# Altium project HV DAC 8ch.PrjPCB (part 6 of 6)

## Sheet HV_Amp_Discrete.SchDoc: Power
size 420 x 297 mm; Author: G.Kasprowicz; CompanyName: WUT ISE; DrawnBy: G.Kasprowicz; Organization: WUT ISE; Address1: PW ISE; Address2: Nowowiejska 15/19 00-665 Warsaw; Address3: gkasprow@gmail.com; DocumentNumber: 2; Revision: 2; SheetNumber: 11; SheetTotal: 12; ModifiedBy: -; CheckedDate: -; Title2: Stage; DivGrp: WUT ISE; Designer: G.Kasprowicz; ModifiedDate: -; ProjectName: Sensor Box
Used 8 times, as channels U_HV_Amp_Discrete0, U_HV_Amp_Discrete1, U_HV_Amp_Discrete2, U_HV_Amp_Discrete3, U_HV_Amp_Discrete4, U_HV_Amp_Discrete5, U_HV_Amp_Discrete6, U_HV_Amp_Discrete7. Parts and nets are listed once, with the designators drawn on the sheet.
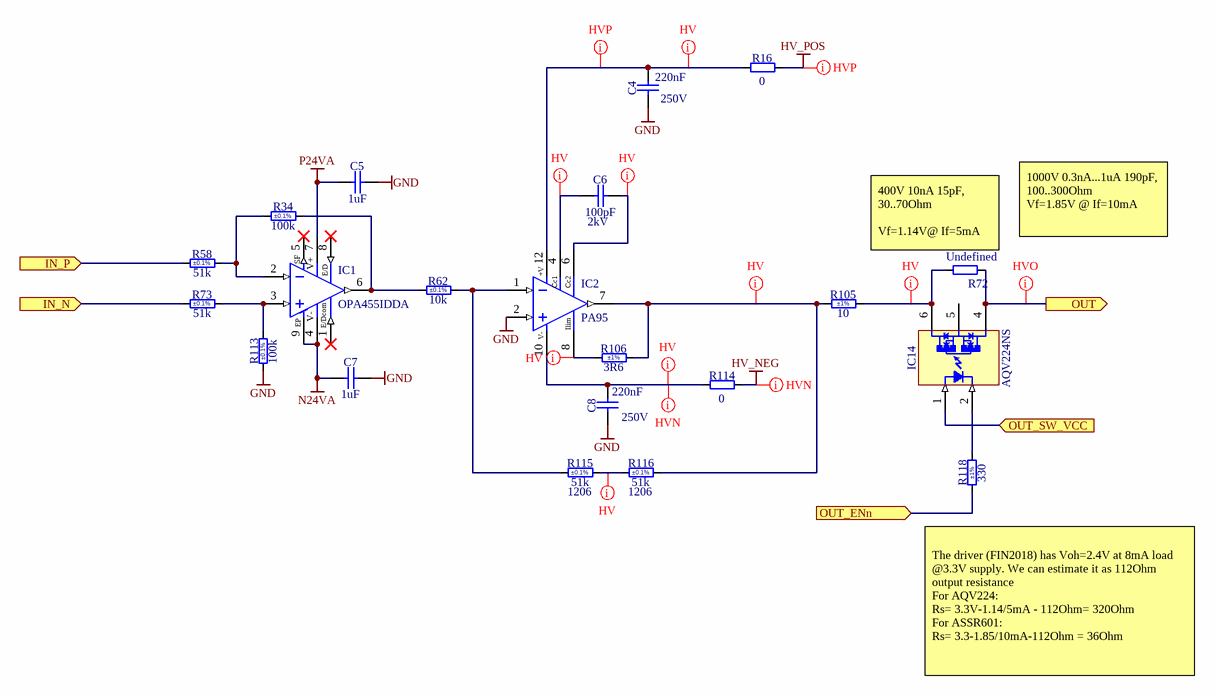
[diagram p9: HV_Amp_Discrete.SchDoc]

### Parts
C4  220nF  Voltage: 250V  [CAPC4532X165N]
C5  1uF  [CAPC1608X87N]
C6  100pF  Voltage: 2kV  [CAPC4620X203N]
C7  1uF  [CAPC1608X87N]
C8  220nF  Voltage: 250V  [CAPC4532X165N]
IC1  OPA455IDDA  [SOIC127P600X170-9N-R249X300]
IC2  PA95  [APEX_PA95_hflip]
IC14  AQV224NS  [PANASONIC_AQV22(SOP)]
R16  0  [RESC1608X55N]
R34  100k  Tolerance: ±0.1%  [RESC1608X55N]
R58  51k  Tolerance: ±0.1%  [RESC2012X60N]
R62  10k  Tolerance: ±0.1%  [RESC1608X64N]
R72  Undefined  [RESC3216X65N]
R73  51k  Tolerance: ±0.1%  [RESC2012X60N]
R105  10  Tolerance: ±1%  [RESC3216X65N]
R106  3R6  Tolerance: ±1%  [RESC1608X55N]
R113  100k  Tolerance: ±0.1%  [RESC1608X55N]
R114  0  [RESC1608X55N]
R115  51k  Tolerance: ±0.1%  Case: 1206  [RESC3216X65N]
R116  51k  Tolerance: ±0.1%  Case: 1206  [RESC3216X65N]
R118  330  Tolerance: ±1%  [RESC1005X40N]

### Ports
IN_N (in), IN_P (in), OUT (out), OUT_ENn (in), OUT_SW_VCC (in)

### Nets
GND: C4.1 C5.2 C7.2 C8.1 IC2.2(IN+) R113.1
HV_NEG: R114.2
HV_POS: R16.2
N24VA: C7.1 IC1.4(V-) IC1.9(Exposed_Pad)
P24VA: C5.1 IC1.7(V+)
IN_N: R73.1 ; port IN_N
IN_P: R58.1 ; port IN_P
OUT: IC14.4 R72.2 ; port OUT
OUT_ENn: R118.1 ; port OUT_ENn
OUT_SW_VCC: IC14.1(A) ; port OUT_SW_VCC
NetC4_2: C4.2 IC2.12(+Vs) R16.1
NetC6_1: C6.1 IC2.4(Cc1)
NetC6_2: C6.2 IC2.6(Cc2)
NetC8_2: C8.2 IC2.10(-Vs) R114.1
NetIC1_2: IC1.2(IN-) R34.1 R58.2
NetIC1_3: IC1.3(IN+) R73.2 R113.2
NetIC1_6: IC1.6(OUT) R34.2 R62.1
NetIC2_1: IC2.1(IN-) R62.2 R115.1
NetIC2_7: IC2.7(OUT) R105.1 R106.2 R116.2
NetIC2_8: IC2.8(ILIM) R106.1
NetIC14_2: IC14.2(K) R118.2
NetIC14_6: IC14.6 R72.1 R105.2
NetR115_2: R115.2 R116.1

Not connected (* = marked no-connect by the designer): IC1 1(E/Dcommon)* 5(Status_Flag)* 8(E/B)*; IC14 5

### Channels
U_HV_Amp_Discrete0: designators end in _1; ports IN_N=DAC_OUT_N IN_P=DAC_OUT_P OUT=OUT0 OUT_ENn=OUT_CTRLn0 OUT_SW_VCC=OUT_SW_VCC
U_HV_Amp_Discrete1: designators end in _2; ports IN_N=DAC_OUT_N IN_P=DAC_OUT_P OUT=OUT1 OUT_ENn=OUT_CTRLn1 OUT_SW_VCC=OUT_SW_VCC
U_HV_Amp_Discrete2: designators end in _3; ports IN_N=DAC_OUT_N IN_P=DAC_OUT_P OUT=OUT2 OUT_ENn=OUT_CTRLn2 OUT_SW_VCC=OUT_SW_VCC
U_HV_Amp_Discrete3: designators end in _4; ports IN_N=DAC_OUT_N IN_P=DAC_OUT_P OUT=OUT3 OUT_ENn=OUT_CTRLn3 OUT_SW_VCC=OUT_SW_VCC
U_HV_Amp_Discrete4: designators end in _5; ports IN_N=DAC_OUT_N IN_P=DAC_OUT_P OUT=OUT4 OUT_ENn=OUT_CTRLn4 OUT_SW_VCC=OUT_SW_VCC
U_HV_Amp_Discrete5: designators end in _6; ports IN_N=DAC_OUT_N IN_P=DAC_OUT_P OUT=OUT5 OUT_ENn=OUT_CTRLn5 OUT_SW_VCC=OUT_SW_VCC
U_HV_Amp_Discrete6: designators end in _7; ports IN_N=DAC_OUT_N IN_P=DAC_OUT_P OUT=OUT6 OUT_ENn=OUT_CTRLn6 OUT_SW_VCC=OUT_SW_VCC
U_HV_Amp_Discrete7: designators end in _8; ports IN_N=DAC_OUT_N IN_P=DAC_OUT_P OUT=OUT7 OUT_ENn=OUT_CTRLn7 OUT_SW_VCC=OUT_SW_VCC

### Layout directives
net class HV: NetC4_1_2, NetC6_1_1, NetC6_1_2, NetC8_1_2, NetIC2_1_7, NetIC2_1_8, NetIC14_1_6, NetR115_1_2
net class HVP: HV_POS, NetC4_1_2
net class HVN: HV_NEG, NetC8_1_2
net class HVO: OUT0

### Notes on the sheet
- (near R72) 400V 10nA 15pF, 30..70Ohm
  Vf=1.14V@ If=5mA
- (near R72) 1000V 0.3nA...1uA 190pF, 100..300Ohm
  Vf=1.85V @ If=10mA
- (near R118) The driver (FIN2018) has Voh=2.4V at 8mA load @3.3V supply. We can estimate it as 112Ohm output resistance
  For AQV224:
  Rs= 3.3V-1.14/5mA - 112Ohm= 320Ohm
  For ASSR601:
  Rs= 3.3-1.85/10mA-112Ohm = 36Ohm
- Project/Equipment
- Document
- Designer
- Drawn by
- Check.by
- Copyright WUT ISE 2020.
  This documentation describes Open Hardware and is licensed under the CERN OHL v.1.2. You may redistribute and modify this documentation under the terms of the CERN OHL v.1.2. (http://ohwr.org/CERNOHL). This documentation is distributed WITHOUT ANY EXPRESS OR IMPLIED WARRANTY, INCLUDING OF MERCHANTABILITY, SATISFACTORY QUALITY AND FITNESS FOR A PARTICULAR PURPOSE. Please see the CERN OHL v.1.2 for applicable conditions.
- Contact
- File
- Last Mod.
- Print Date
- Sheet
- Size
- A3
- of
- Rev
- (in symbol OA_OPA455) SF; E/D; E/Dcom; EP
- (in symbol OA_PA95) +V; V-; Ilim

### Library data of the parts
C4 C8 = CC1812_220NF_250V_10%_X7R_FT-CAP: Non-polarised capacitor; Part Description: Flexible Termination System (FT-CAP) SMD Multilayer Ceramic  Chip Capacitor; Manufacturer: KEMET; Manufacturer Part Number: C1812X224KARACTU; TC: X7R; Tolerance: ±10%; Part Number: CC1812_220NF_250V_10%_X7R_FT-CAP; Component Kind: Standard; Component Type: Standard; Pin Count: 2; Value: 220nF; Status: None; Case: 1812; Mounted: Yes; Socket: No; SMD: Yes; Sense: No; ComponentHeight: 1.65mm; HelpURL: \\cern.ch\dfs\Applications\Altium\Datasheets\CC1812_X7R_KEMET_FT-CAP.pdf; Author: CERN DEM JLC; CreateDate: 09.08.2018; LatestRevisionDate: 09.08.2018
C5 C7 = CC0603_1UF_50V_10%_X5R: Non-polarised capacitor; Part Description: SMD Multilayer Chip Ceramic Capacitor; Manufacturer: GENERIC; Manufacturer1 Part Number: C1608X5R1H105K080; Voltage: 50V; TC: X5R; Tolerance: ±10%; Part Number: CC0603_1UF_50V_10%_X5R; Component Kind: Standard; Component Type: Standard; Pin Count: 2; Value: 1uF; Status: None; Manufacturer Part Number: CC0603_1UF_50V_10%_X5R; Case: 0603; Mounted: Yes; Socket: No; SMD: Yes; Sense: No; Manufacturer1 Example: TDK; Manufacturer1 ComponentHeight: 0.9mm; HelpURL: \\cern.ch\dfs\Applications\Altium\Datasheets\CC0603_X5R_TDK_C.pdf; Author: CERN DEM JMW; CreateDate: 09.11.2015; LatestRevisionDate: 09.11.2015
C6 = CC1808_100PF_2KV_5%_C0G: Non-polarised capacitor; Part Description: High Voltage MLC Chip Capacitor; Manufacturer: GENERIC; Manufacturer1 Part Number: 1808GA101JAT1A; TC: C0G/NP0; Tolerance: ±5%; Part Number: CC1808_100PF_2KV_5%_C0G; Component Kind: Standard; Component Type: Standard; Pin Count: 2; Value: 100pF; Status: None; Manufacturer Part Number: CC1808_100PF_2KV_5%_C0G; Case: 1808; Mounted: Yes; Socket: No; SMD: Yes; Sense: No; Manufacturer1 Example: AVX; Manufacturer1 ComponentHeight: 2.03mm; HelpURL: \\cern.ch\dfs\Applications\Altium\Datasheets\CC1808_C0G_AVX_HV-MLC.pdf; Author: CERN DEM JLC; CreateDate: 25.11.2014; LatestRevisionDate: 16.11.2017
IC1 = OA_OPA455: High-Voltage (150V), High-Current (50mA) Operational Amplifier, G=1 Stable; Manufacturer: TEXAS INSTRUMENTS; PressFit: No; Bonding: No; Part Number: OPA455IDDA; Component Kind: Standard; Component Type: Standard; Device: OPA455IDDA; PackageDescription: SOIC, 1.27mm Pitch; 8 Pin, 4.00mm W X 5.00mm L X 1.70mm H body (w/Thermal Tab 2.49 X 3.00mm), IPC Medium Density; Part Description: High-Voltage (150V), High-Current (50mA) Operational Amplifier, G=1 Stable; Manufacturer Part Number: OPA455IDDA; Pin Count: 9; Case: SOIC8; Mounted: Yes; Socket: No; SMD: Yes; Sense: No; ComponentHeight: 1.70mm; Author: GK; HelpURL: \\cern.ch\dfs\Applications\Altium\Datasheets\OPA454AIDDA.pdf; CreateDate: 23.05.2011; LatestRevisionDate: 23.05.2011
IC2 = OA_PA95: High Voltage Power Operational Amplifier; Part Number: PA95_hflip; Part Description: 100mA 900V High Voltage Power Operational Amplifier (DQ Case Style); Manufacturer: APEX; PressFit: No; Bonding: No; Component Kind: Standard; Component Type: Standard; Device: PA95; PackageDescription: Power SIP, DQ Package Style, Pitch 2.54mm, Reverse Right Angle Formed Original Straight Leads For Flipped  Horizontal Mount; Manufacturer Part Number: PA95; Pin Count: 8; Mounted: Yes; Socket: No; SMD: No; Sense: No; ComponentHeight: 10mm; Author: GK; HelpURL: \\cern.ch\dfs\Applications\Altium\Datasheets\PA94.pdf; ComponentLink1URL: \\cern.ch\dfs\Applications\Altium\Datasheets\PA94_v_Package.pdf; ComponentLink1Description: Package Drawing; CreateDate: 04.12.2008; LatestRevisionDate: 12.01.2010
IC14 = OPTOMOS_AQV224NS: PhotoMOS Relay 400V 40mA; Part Description: GU SOP 1 Form A, PhotoMOS Relay, 400V 40mA; Manufacturer: PANASONIC; PressFit: No; Bonding: No; Part Number: AQV224NS; Component Kind: Standard; Component Type: Standard; Device: AQV224NS; Footprint: PANASONIC_AQV224NS; PackageDescription: PANASONIC Serie AQV21(SOP), 2.54mm Pitch; 6 Pin, 4.40mm W X 6.30mm L X 2.30mm H body; Manufacturer Part Number: AQV224NS; Pin Count: 6; Case: SOP6; Mounted: Yes; Socket: No; SMD: Yes; Sense: No; ComponentHeight: 2.3mm; HelpURL: \\cern.ch\dfs\Applications\Altium\Datasheets\AQV212S.pdf; ComponentLink1Description: Package Drawing; ComponentLink1URL: \\cern.ch\dfs\Applications\Altium\Datasheets\AQV21_Package-Drawing.pdf; Author: GK; CreateDate: 03.09.2010; LatestRevisionDate: 04.12.2018
R16 R114 = R0603_0R_JUMPER: Resistor; Part Description: 1A (0.05R Max DC Resistance) Zero Ohm Jumper; Manufacturer: GENERIC; Manufacturer1 Part Number: NRC06Z0; PressFit: No; Part Number: R0603_0R_JUMPER; Component Kind: Standard; Component Type: Standard; Pin Count: 2; Value: 0; Status: Preferred; Manufacturer Part Number: R0603_0R_JUMPER; Case: 0603; Mounted: Yes; Sense: No; Socket: No; SMD: Yes; Manufacturer1 Example: NIC COMPONENT; Manufacturer1 ComponentHeight: 0.55mm; HelpURL: \\cern.ch\dfs\Applications\Altium\Datasheets\R0603_NIC_NRC.pdf; Author: CERN DEM JLC; CreateDate: 03.12.2007; LatestRevisionDate: 13.03.2008
R34 R113 = R0603_100K_0.1%_0.063W_10PPM: Resistor - 0.1%; Part Description: Thin Film Chip Resistor; Manufacturer: GENERIC; Manufacturer1 Part Number: RN73C1J100KBTDF; Power: 0.063W; TC: ±10ppm; PressFit: No; Part Number: R0603_100K_0.1%_0.063W_10PPM; Component Kind: Standard; Component Type: Standard; Pin Count: 2; Value: 100k; Status: Not Recommended; Manufacturer Part Number: R0603_100K_0.1%_0.063W_10PPM; Case: 0603; Mounted: Yes; Sense: No; Socket: No; SMD: Yes; Manufacturer1 Example: TYCO HOLSWORTHY; Manufacturer1 ComponentHeight: 0.55mm; HelpURL: \\cern.ch\dfs\Applications\Altium\Datasheets\R0603_Tyco_RN73.pdf; Author: CERN DEM JLC; CreateDate: 03.12.2007; LatestRevisionDate: 13.03.2008
R58 R73 = R0805_51K_0.1%_0.125W_10PPM: Resistor - 0.1%; Part Description: Thin Film Chip Resistor; Manufacturer: GENERIC; Manufacturer1 Part Number: ERA6ARB513V; Power: 0.125W; TC: ±10ppm; PressFit: No; Part Number: R0805_51K_0.1%_0.125W_10PPM; Component Kind: Standard; Component Type: Standard; Pin Count: 2; Value: 51k; Status: Not Recommended; Manufacturer Part Number: R0805_51K_0.1%_0.125W_10PPM; Case: 0805; Mounted: Yes; Sense: No; Socket: No; SMD: Yes; Manufacturer1 Example: PANASONIC; Manufacturer1 ComponentHeight: 0.6mm; HelpURL: \\cern.ch\dfs\Applications\Altium\Datasheets\R0805_PANASONIC_ERA.pdf; Author: CERN DEM BC; CreateDate: 26.09.2019; LatestRevisionDate: 26.09.2019
R62 = R0603_10K_0.1%_0.1W_25PPM: Resistor - 0.1%; Part Description: Thin Film Chip Resistor; Manufacturer: GENERIC; Manufacturer1 Part Number: ERA3AEB103V; Power: 0.1W; TC: ±25ppm/°C; PressFit: No; Part Number: R0603_10K_0.1%_0.1W_25PPM; Component Kind: Standard; Component Type: Standard; Pin Count: 2; Value: 10k; Status: Not Recommended; Manufacturer Part Number: R0603_10K_0.1%_0.1W_25PPM; Case: 0603; Mounted: Yes; Sense: No; Socket: No; SMD: Yes; Manufacturer1 Example: PANASONIC; Manufacturer1 ComponentHeight: 0.55mm; HelpURL: \\cern.ch\dfs\Applications\Altium\Datasheets\R0603_PANASONIC_ERA.pdf; Author: CERN DEM JMW; CreateDate: 09.11.2015; LatestRevisionDate: 11.01.2017
R72 = R1206_NO-VALUE: Resistor; Part Description: Reserved Footprint For a 1206 (3216) Chip Resistor; PressFit: No; Mounted: No; Part Number: R1206_NO-VALUE; Component Kind: Standard; Component Type: Standard; Pin Count: 2; Value: Undefined; Status: None; Manufacturer: Undefined; Manufacturer Part Number: R1206_NO-VALUE; Case: 1206; Sense: No; Socket: No; SMD: Yes; Manufacturer1 Example: Undefined; Manufacturer1 Part Number: Undefined; Manufacturer1 ComponentHeight: Undefined; HelpURL: Undefined; Author: CERN DEM JLC; CreateDate: 03.12.2007; LatestRevisionDate: 13.03.2008
R105 = R1206_10R_1%_0.25W_200PPM: Resistor - 1%; Part Description: General Purpose Thick Film Chip Resistor; Manufacturer: GENERIC; Manufacturer1 Part Number: NRC12F10R0TRF; Power: 0.25W; TC: ±200ppm/°C; PressFit: No; Part Number: R1206_10R_1%_0.25W_200PPM; Component Kind: Standard; Component Type: Standard; Pin Count: 2; Value: 10; Status: Preferred; Manufacturer Part Number: R1206_10R_1%_0.25W_200PPM; Case: 1206; Mounted: Yes; Sense: No; Socket: No; SMD: Yes; Manufacturer1 Example: NIC COMPONENT; Manufacturer1 ComponentHeight: 0.65mm; HelpURL: \\cern.ch\dfs\Applications\Altium\Datasheets\R1206_NIC_NRC.pdf; Author: CERN DEM JLC; CreateDate: 24.06.2009; LatestRevisionDate: 24.06.2009
R106 = R0603_3R6_1%_0.1W_200PPM: Resistor - 1%; Part Description: General Purpose Thick Film Chip Resistor; Manufacturer: GENERIC; Manufacturer1 Part Number: 232270463608L or RC0603FR-073R6L; Power: 0.1W; TC: ±200ppm/°C; PressFit: No; Part Number: R0603_3R6_1%_0.1W_200PPM; Component Kind: Standard; Component Type: Standard; Pin Count: 2; Value: 3R6; Status: Preferred; Manufacturer Part Number: R0603_3R6_1%_0.1W_200PPM; Case: 0603; Mounted: Yes; Sense: No; Socket: No; SMD: Yes; Manufacturer1 Example: YAGEO PHYCOMP; Manufacturer1 ComponentHeight: 0.65mm; HelpURL: \\cern.ch\dfs\Applications\Altium\Datasheets\R0603_Phycomp_RC0603.pdf; Author: CERN DEM JLC; CreateDate: 03.12.2007; LatestRevisionDate: 17.10.2012
R115 R116 = R1206_51K_0.1%_0.25W_25PPM: Resistor - 0.1%; Part Description: Thin Film Chip Resistor; Manufacturer: GENERIC; Manufacturer1 Part Number: RN73H2BTTD5102B25; Power: 0.25W; TC: ±25ppm/°C; PressFit: No; Part Number: R1206_51K_0.1%_0.25W_25PPM; Component Kind: Standard; Component Type: Standard; Pin Count: 2; Value: 51k; Status: Not Recommended; Manufacturer Part Number: R1206_51K_0.1%_0.25W_25PPM; Mounted: Yes; Sense: No; Socket: No; SMD: Yes; Manufacturer1 Example: KOA; Manufacturer1 ComponentHeight: 0.70mm; HelpURL: \\cern.ch\dfs\Applications\Altium\Datasheets\R1206_KOA_RN73H.pdf; Author: CERN DEM JLC; CreateDate: 03.12.2007; LatestRevisionDate: 13.03.2008
R118 = R0402_330R_1%_0.0625W_100PPM: Resistor - 1%; Part Description: General Purpose Thick Film Chip Resistor; Manufacturer: GENERIC; Manufacturer1 Part Number: 232270673301L; TC: ±100ppm/°C; PressFit: No; Part Number: R0402_330R_1%_0.0625W_100PPM; Component Kind: Standard; Component Type: Standard; Pin Count: 2; Value: 330; Status: Not Recommended; Power: 0.0625W; Manufacturer Part Number: R0402_330R_1%_0.0625W_100PPM; Case: 0402; Mounted: Yes; Sense: No; Socket: No; SMD: Yes; Manufacturer1 Example: YAGEO PHYCOMP; Manufacturer1 ComponentHeight: 0.4mm; HelpURL: \\cern.ch\dfs\Applications\Altium\Datasheets\R0402_Phycomp_RC0402.pdf; Author: CERN DEM JLC; CreateDate: 03.12.2007; LatestRevisionDate: 17.10.2012

## Nets that join several sheets
GND: HV_DAC_8ch-DIOT (15 pins), DAC_channel1 (22 pins), DAC_channel2 (22 pins), DAC_channel3 (22 pins), DAC_channel4 (22 pins), DAC_channel5 (22 pins), DAC_channel6 (22 pins), DAC_channel7 (22 pins), DAC_channel8 (22 pins), HV_DAC_8ch_FPGA (5 pins), HV_DAC_8ch_FPGA_Config (18 pins), HV_DAC_8ch_FPGA_LVDS (18 pins), HV_DAC_8ch_References (22 pins), HV_DAC_8ch_Supply (97 pins), HV_DAC_8ch_DIOT_Connectors_P1_P6 (68 pins), power_supplies_HVAMP (69 pins), U_HV_Amp_Discrete0 (6 pins), U_HV_Amp_Discrete1 (6 pins), U_HV_Amp_Discrete2 (6 pins), U_HV_Amp_Discrete3 (6 pins), U_HV_Amp_Discrete4 (6 pins), U_HV_Amp_Discrete5 (6 pins), U_HV_Amp_Discrete6 (6 pins), U_HV_Amp_Discrete7 (6 pins)
HV_NEG: power_supplies_HVAMP (8 pins), U_HV_Amp_Discrete0 (R114_1.2), U_HV_Amp_Discrete1 (R114_2.2), U_HV_Amp_Discrete2 (R114_3.2), U_HV_Amp_Discrete3 (R114_4.2), U_HV_Amp_Discrete4 (R114_5.2), U_HV_Amp_Discrete5 (R114_6.2), U_HV_Amp_Discrete6 (R114_7.2), U_HV_Amp_Discrete7 (R114_8.2)
HV_POS: power_supplies_HVAMP (8 pins), U_HV_Amp_Discrete0 (R16_1.2), U_HV_Amp_Discrete1 (R16_2.2), U_HV_Amp_Discrete2 (R16_3.2), U_HV_Amp_Discrete3 (R16_4.2), U_HV_Amp_Discrete4 (R16_5.2), U_HV_Amp_Discrete5 (R16_6.2), U_HV_Amp_Discrete6 (R16_7.2), U_HV_Amp_Discrete7 (R16_8.2)
N12V0A: DAC_channel1 (L18_1.1), DAC_channel2 (L18_2.1), DAC_channel3 (L18_3.1), DAC_channel4 (L18_4.1), DAC_channel5 (L18_5.1), DAC_channel6 (L18_6.1), DAC_channel7 (L18_7.1), DAC_channel8 (L18_8.1), HV_DAC_8ch_Supply (10 pins)
N24VA: power_supplies_HVAMP (6 pins), U_HV_Amp_Discrete0 (C7_1.1 IC1_1.4 IC1_1.9), U_HV_Amp_Discrete1 (C7_2.1 IC1_2.4 IC1_2.9), U_HV_Amp_Discrete2 (C7_3.1 IC1_3.4 IC1_3.9), U_HV_Amp_Discrete3 (C7_4.1 IC1_4.4 IC1_4.9), U_HV_Amp_Discrete4 (C7_5.1 IC1_5.4 IC1_5.9), U_HV_Amp_Discrete5 (C7_6.1 IC1_6.4 IC1_6.9), U_HV_Amp_Discrete6 (C7_7.1 IC1_7.4 IC1_7.9), U_HV_Amp_Discrete7 (C7_8.1 IC1_8.4 IC1_8.9)
P3V3: HV_DAC_8ch-DIOT (C170.2 IC41.5), HV_DAC_8ch_FPGA (5 pins), HV_DAC_8ch_FPGA_Config (10 pins), HV_DAC_8ch_FPGA_LVDS (LD19.2 R74.1 R78.1), HV_DAC_8ch_Supply (11 pins)
P3V3_MP: HV_DAC_8ch_FPGA_Config (13 pins), HV_DAC_8ch_FPGA_LVDS (13 pins), HV_DAC_8ch_Supply (R160.1), HV_DAC_8ch_DIOT_Connectors_P1_P6 (D7.1)
P5V4A: DAC_channel1 (L16_1.1 R164_1.1), DAC_channel2 (L16_2.1 R164_2.1), DAC_channel3 (L16_3.1 R164_3.1), DAC_channel4 (L16_4.1 R164_4.1), DAC_channel5 (L16_5.1 R164_5.1), DAC_channel6 (L16_6.1 R164_6.1), DAC_channel7 (L16_7.1 R164_7.1), DAC_channel8 (L16_8.1 R164_8.1), HV_DAC_8ch_References (10 pins), HV_DAC_8ch_Supply (8 pins)
P12V0: HV_DAC_8ch-DIOT (R274.1), HV_DAC_8ch_Supply (C48.2 L5.1 R20.2 TP7.1), HV_DAC_8ch_DIOT_Connectors_P1_P6 (10 pins), power_supplies_HVAMP (7 pins)
P12V0A: DAC_channel1 (L2_1.1), DAC_channel2 (L2_2.1), DAC_channel3 (L2_3.1), DAC_channel4 (L2_4.1), DAC_channel5 (L2_5.1), DAC_channel6 (L2_6.1), DAC_channel7 (L2_7.1), DAC_channel8 (L2_8.1), HV_DAC_8ch_FPGA_LVDS (R70.2 R108.2), HV_DAC_8ch_Supply (9 pins)
P24VA: power_supplies_HVAMP (6 pins), U_HV_Amp_Discrete0 (C5_1.1 IC1_1.7), U_HV_Amp_Discrete1 (C5_2.1 IC1_2.7), U_HV_Amp_Discrete2 (C5_3.1 IC1_3.7), U_HV_Amp_Discrete3 (C5_4.1 IC1_4.7), U_HV_Amp_Discrete4 (C5_5.1 IC1_5.7), U_HV_Amp_Discrete5 (C5_6.1 IC1_6.7), U_HV_Amp_Discrete6 (C5_7.1 IC1_7.7), U_HV_Amp_Discrete7 (C5_8.1 IC1_8.7)
BP_I2C.SCL: HV_DAC_8ch_FPGA_LVDS (R233.1), HV_DAC_8ch_DIOT_Connectors_P1_P6 (D5.3 J8.B2)
BP_I2C.SDA: HV_DAC_8ch_FPGA_LVDS (R3.1), HV_DAC_8ch_DIOT_Connectors_P1_P6 (D5.1 J8.C2)
BP_IO.LVDS_N0: HV_DAC_8ch_FPGA_LVDS (R75.1 R206.2), HV_DAC_8ch_DIOT_Connectors_P1_P6 (J8.E3)
BP_IO.LVDS_N1: HV_DAC_8ch_FPGA_LVDS (R95.1 R176.2), HV_DAC_8ch_DIOT_Connectors_P1_P6 (J8.B3)
BP_IO.LVDS_N2: HV_DAC_8ch_FPGA_LVDS (R96.1 R180.2), HV_DAC_8ch_DIOT_Connectors_P1_P6 (J8.C4)
BP_IO.LVDS_N3: HV_DAC_8ch_FPGA_LVDS (R37.1 R184.2), HV_DAC_8ch_DIOT_Connectors_P1_P6 (J8.L4)
BP_IO.LVDS_N4: HV_DAC_8ch_FPGA_LVDS (R85.1 R216.2), HV_DAC_8ch_DIOT_Connectors_P1_P6 (J8.I4)
BP_IO.LVDS_N5: HV_DAC_8ch_FPGA_LVDS (R59.1 R190.2), HV_DAC_8ch_DIOT_Connectors_P1_P6 (J8.K5)
BP_IO.LVDS_N6: HV_DAC_8ch_FPGA_LVDS (R98.1 R192.2), HV_DAC_8ch_DIOT_Connectors_P1_P6 (J8.H5)
BP_IO.LVDS_N7: HV_DAC_8ch_FPGA_LVDS (R99.1 R194.2), HV_DAC_8ch_DIOT_Connectors_P1_P6 (J8.F6)
BP_IO.LVDS_N8: HV_DAC_8ch_FPGA_LVDS (R97.1 R188.2), HV_DAC_8ch_DIOT_Connectors_P1_P6 (J8.C6)
BP_IO.LVDS_N9: HV_DAC_8ch_FPGA_LVDS (R102.1 R196.2), HV_DAC_8ch_DIOT_Connectors_P1_P6 (J8.L6)
BP_IO.LVDS_N10: HV_DAC_8ch_FPGA_LVDS (R172.1 R198.2), HV_DAC_8ch_DIOT_Connectors_P1_P6 (J8.I6)
BP_IO.LVDS_N11: HV_DAC_8ch_FPGA_LVDS (R71.1 R200.2), HV_DAC_8ch_DIOT_Connectors_P1_P6 (J9.E1)
BP_IO.LVDS_N12: HV_DAC_8ch_FPGA_LVDS (R107.1 R208.2), HV_DAC_8ch_DIOT_Connectors_P1_P6 (J9.B1)
BP_IO.LVDS_N13: HV_DAC_8ch_FPGA_LVDS (R79.1 R210.2), HV_DAC_8ch_DIOT_Connectors_P1_P6 (J9.K1)
BP_IO.LVDS_N14: HV_DAC_8ch_FPGA_LVDS (R81.1 R212.2), HV_DAC_8ch_DIOT_Connectors_P1_P6 (J9.H1)
BP_IO.LVDS_N15: HV_DAC_8ch_FPGA_LVDS (R83.1 R214.2), HV_DAC_8ch_DIOT_Connectors_P1_P6 (J8.F2)
BP_IO.LVDS_P0: HV_DAC_8ch_FPGA_LVDS (R75.2 R207.2), HV_DAC_8ch_DIOT_Connectors_P1_P6 (J8.D3)
BP_IO.LVDS_P1: HV_DAC_8ch_FPGA_LVDS (R95.2 R178.2), HV_DAC_8ch_DIOT_Connectors_P1_P6 (J8.A3)
BP_IO.LVDS_P2: HV_DAC_8ch_FPGA_LVDS (R96.2 R182.2), HV_DAC_8ch_DIOT_Connectors_P1_P6 (J8.B4)
BP_IO.LVDS_P3: HV_DAC_8ch_FPGA_LVDS (R37.2 R186.2), HV_DAC_8ch_DIOT_Connectors_P1_P6 (J8.K4)
BP_IO.LVDS_P4: HV_DAC_8ch_FPGA_LVDS (R85.2 R217.2), HV_DAC_8ch_DIOT_Connectors_P1_P6 (J8.H4)
BP_IO.LVDS_P5: HV_DAC_8ch_FPGA_LVDS (R59.2 R191.2), HV_DAC_8ch_DIOT_Connectors_P1_P6 (J8.J5)
BP_IO.LVDS_P6: HV_DAC_8ch_FPGA_LVDS (R98.2 R193.2), HV_DAC_8ch_DIOT_Connectors_P1_P6 (J8.G5)
BP_IO.LVDS_P7: HV_DAC_8ch_FPGA_LVDS (R99.2 R195.2), HV_DAC_8ch_DIOT_Connectors_P1_P6 (J8.E6)
BP_IO.LVDS_P8: HV_DAC_8ch_FPGA_LVDS (R97.2 R189.2), HV_DAC_8ch_DIOT_Connectors_P1_P6 (J8.B6)
BP_IO.LVDS_P9: HV_DAC_8ch_FPGA_LVDS (R102.2 R197.2), HV_DAC_8ch_DIOT_Connectors_P1_P6 (J8.K6)
BP_IO.LVDS_P10: HV_DAC_8ch_FPGA_LVDS (R172.2 R199.2), HV_DAC_8ch_DIOT_Connectors_P1_P6 (J8.H6)
BP_IO.LVDS_P11: HV_DAC_8ch_FPGA_LVDS (R71.2 R203.2), HV_DAC_8ch_DIOT_Connectors_P1_P6 (J9.D1)
BP_IO.LVDS_P12: HV_DAC_8ch_FPGA_LVDS (R107.2 R209.2), HV_DAC_8ch_DIOT_Connectors_P1_P6 (J9.A1)
BP_IO.LVDS_P13: HV_DAC_8ch_FPGA_LVDS (R79.2 R211.2), HV_DAC_8ch_DIOT_Connectors_P1_P6 (J9.J1)
BP_IO.LVDS_P14: HV_DAC_8ch_FPGA_LVDS (R81.2 R213.2), HV_DAC_8ch_DIOT_Connectors_P1_P6 (J9.G1)
BP_IO.LVDS_P15: HV_DAC_8ch_FPGA_LVDS (R83.2 R215.2), HV_DAC_8ch_DIOT_Connectors_P1_P6 (J8.E2)
DAC_CLK1: HV_DAC_8ch-DIOT (TP4.1), DAC_channel1 (C66_1.1 IC37_1.8)
DAC_LDACn1: HV_DAC_8ch-DIOT (TP19.1), DAC_channel1 (C89_1.1 IC37_1.11)
DAC_MOSI1: HV_DAC_8ch-DIOT (TP18.1), DAC_channel1 (C68_1.1 IC37_1.9)
DAC_NSS1: HV_DAC_8ch-DIOT (TP15.1), DAC_channel1 (C35_1.1 IC37_1.6)
DAC_OUT_N: DAC_channel1 (R67_1.2), U_HV_Amp_Discrete0 (R73_1.1)
DAC_OUT_N: DAC_channel2 (R67_2.2), U_HV_Amp_Discrete1 (R73_2.1)
DAC_OUT_N: DAC_channel3 (R67_3.2), U_HV_Amp_Discrete2 (R73_3.1)
DAC_OUT_N: DAC_channel4 (R67_4.2), U_HV_Amp_Discrete3 (R73_4.1)
DAC_OUT_N: DAC_channel5 (R67_5.2), U_HV_Amp_Discrete4 (R73_5.1)
DAC_OUT_N: DAC_channel6 (R67_6.2), U_HV_Amp_Discrete5 (R73_6.1)
DAC_OUT_N: DAC_channel7 (R67_7.2), U_HV_Amp_Discrete6 (R73_7.1)
DAC_OUT_N: DAC_channel8 (R67_8.2), U_HV_Amp_Discrete7 (R73_8.1)
DAC_OUT_P: DAC_channel1 (D21_1.3 R2_1.2), U_HV_Amp_Discrete0 (R58_1.1)
DAC_OUT_P: DAC_channel2 (D21_2.3 R2_2.2), U_HV_Amp_Discrete1 (R58_2.1)
DAC_OUT_P: DAC_channel3 (D21_3.3 R2_3.2), U_HV_Amp_Discrete2 (R58_3.1)
DAC_OUT_P: DAC_channel4 (D21_4.3 R2_4.2), U_HV_Amp_Discrete3 (R58_4.1)
DAC_OUT_P: DAC_channel5 (D21_5.3 R2_5.2), U_HV_Amp_Discrete4 (R58_5.1)
DAC_OUT_P: DAC_channel6 (D21_6.3 R2_6.2), U_HV_Amp_Discrete5 (R58_6.1)
DAC_OUT_P: DAC_channel7 (D21_7.3 R2_7.2), U_HV_Amp_Discrete6 (R58_7.1)
DAC_OUT_P: DAC_channel8 (D21_8.3 R2_8.2), U_HV_Amp_Discrete7 (R58_8.1)
DAC_REF_P5V1: DAC_channel1 (6 pins), HV_DAC_8ch_References (R1.2)
DAC_REF_P5V2: DAC_channel2 (6 pins), HV_DAC_8ch_References (R272.2)
DAC_REF_P5V3: DAC_channel3 (6 pins), HV_DAC_8ch_References (R4.2)
DAC_REF_P5V4: DAC_channel4 (6 pins), HV_DAC_8ch_References (R5.2)
DAC_REF_P5V5: DAC_channel5 (6 pins), HV_DAC_8ch_References (R6.2)
DAC_REF_P5V6: DAC_channel6 (6 pins), HV_DAC_8ch_References (R10.2)
DAC_REF_P5V7: DAC_channel7 (6 pins), HV_DAC_8ch_References (R12.2)
DAC_REF_P5V8: DAC_channel8 (6 pins), HV_DAC_8ch_References (R14.2)
DAC_SPI_CLRn: HV_DAC_8ch-DIOT (TP20.1), DAC_channel1 (IC37_1.10), DAC_channel2 (IC37_2.10), DAC_channel3 (IC37_3.10), DAC_channel4 (IC37_4.10), DAC_channel5 (IC37_5.10), DAC_channel6 (IC37_6.10), DAC_channel7 (IC37_7.10), DAC_channel8 (IC37_8.10), HV_DAC_8ch_FPGA (U1.A7)
EEM0_SCL: HV_DAC_8ch_FPGA (U1.M15), HV_DAC_8ch_FPGA_LVDS (R74.2 T6.2)
EEM0_SDA: HV_DAC_8ch_FPGA (U1.J11), HV_DAC_8ch_FPGA_LVDS (R78.2 T9.2)
En_AFE_PWR: HV_DAC_8ch_FPGA (U1.B4), HV_DAC_8ch_Supply (IC4.3 IC13.3 R48.2)
FLASH_SCK: HV_DAC_8ch_FPGA (U1.R11), HV_DAC_8ch_FPGA_Config (IC6.6 IC17.2 JP1.4)
FLASH_SDI: HV_DAC_8ch_FPGA (U1.P12), HV_DAC_8ch_FPGA_Config (IC6.5 IC17.3 JP1.2)
FLASH_SDO: HV_DAC_8ch_FPGA (U1.P11), HV_DAC_8ch_FPGA_Config (IC6.2 IC17.9 JP1.3)
FLASH_SS: HV_DAC_8ch_FPGA (U1.R12), HV_DAC_8ch_FPGA_Config (IC6.1 IC17.10 JP1.1 R204.1)
FPGA_CDONE: HV_DAC_8ch_FPGA (U1.M10), HV_DAC_8ch_FPGA_Config (JP1.10 R39.2 R41.1 T2.1)
FPGA_CRESET: HV_DAC_8ch_FPGA (U1.N11), HV_DAC_8ch_FPGA_Config (JP1.9 R42.2 R44.1 R46.2)
FPGA_CSBSEL0: HV_DAC_8ch_FPGA (U1.K11), HV_DAC_8ch_FPGA_Config (R47.2 SW1.8)
FPGA_CSBSEL1: HV_DAC_8ch_FPGA (U1.P13), HV_DAC_8ch_FPGA_Config (R31.2 SW1.7)
I2C0_SCL: HV_DAC_8ch_FPGA_Config (IC10.8 IC30.2), HV_DAC_8ch_FPGA_LVDS (8 pins)
I2C0_SDA: HV_DAC_8ch_FPGA_Config (IC10.7 IC30.1), HV_DAC_8ch_FPGA_LVDS (8 pins)
OUT0: HV_DAC_8ch-DIOT (J3.1), U_HV_Amp_Discrete0 (IC14_1.4 R72_1.2)
OUT1: HV_DAC_8ch-DIOT (J4.1), U_HV_Amp_Discrete1 (IC14_2.4 R72_2.2)
OUT2: HV_DAC_8ch-DIOT (J5.1), U_HV_Amp_Discrete2 (IC14_3.4 R72_3.2)
OUT3: HV_DAC_8ch-DIOT (J7.1), U_HV_Amp_Discrete3 (IC14_4.4 R72_4.2)
OUT4: HV_DAC_8ch-DIOT (J12.1), U_HV_Amp_Discrete4 (IC14_5.4 R72_5.2)
OUT5: HV_DAC_8ch-DIOT (J13.1), U_HV_Amp_Discrete5 (IC14_6.4 R72_6.2)
OUT6: HV_DAC_8ch-DIOT (J14.1), U_HV_Amp_Discrete6 (IC14_7.4 R72_7.2)
OUT7: HV_DAC_8ch-DIOT (J15.1), U_HV_Amp_Discrete7 (IC14_8.4 R72_8.2)
OUT_CTRLn0: HV_DAC_8ch-DIOT (R278.2), HV_DAC_8ch_FPGA_LVDS (U1.L3), U_HV_Amp_Discrete0 (R118_1.1)
OUT_CTRLn1: HV_DAC_8ch-DIOT (R279.2), HV_DAC_8ch_FPGA_LVDS (U1.L6), U_HV_Amp_Discrete1 (R118_2.1)
OUT_CTRLn2: HV_DAC_8ch-DIOT (R280.2), HV_DAC_8ch_FPGA_LVDS (U1.M2), U_HV_Amp_Discrete2 (R118_3.1)
OUT_CTRLn3: HV_DAC_8ch-DIOT (R281.2), HV_DAC_8ch_FPGA_LVDS (U1.K5), U_HV_Amp_Discrete3 (R118_4.1)
OUT_CTRLn4: HV_DAC_8ch-DIOT (R282.2), HV_DAC_8ch_FPGA_LVDS (U1.N2), U_HV_Amp_Discrete4 (R118_5.1)
OUT_CTRLn5: HV_DAC_8ch-DIOT (R283.2), HV_DAC_8ch_FPGA_LVDS (U1.L7), U_HV_Amp_Discrete5 (R118_6.1)
OUT_CTRLn6: HV_DAC_8ch-DIOT (R284.2), HV_DAC_8ch_FPGA_LVDS (U1.M3), U_HV_Amp_Discrete6 (R118_7.1)
OUT_CTRLn7: HV_DAC_8ch-DIOT (R285.2), HV_DAC_8ch_FPGA_LVDS (U1.M6), U_HV_Amp_Discrete7 (R118_8.1)
OUT_SW_VCC: HV_DAC_8ch-DIOT (9 pins), U_HV_Amp_Discrete0 (IC14_1.1), U_HV_Amp_Discrete1 (IC14_2.1), U_HV_Amp_Discrete2 (IC14_3.1), U_HV_Amp_Discrete3 (IC14_4.1), U_HV_Amp_Discrete4 (IC14_5.1), U_HV_Amp_Discrete5 (IC14_6.1), U_HV_Amp_Discrete6 (IC14_7.1), U_HV_Amp_Discrete7 (IC14_8.1)
PGOOD: HV_DAC_8ch_FPGA_Config (R42.1), HV_DAC_8ch_References (IC11.1 IC12.1 IC19.3), HV_DAC_8ch_Supply (IC21.4 R51.2 T3.3), HV_DAC_8ch_DIOT_Connectors_P1_P6 (R171.1 T10.1)
PWR_EN: HV_DAC_8ch_FPGA_LVDS (R86.2 R89.2), HV_DAC_8ch_Supply (IC8.3), HV_DAC_8ch_DIOT_Connectors_P1_P6 (R226.2), power_supplies_HVAMP (R202.1)
SERVMOD_3V3: HV_DAC_8ch_FPGA_LVDS (IC25.5 IC25.13), HV_DAC_8ch_DIOT_Connectors_P1_P6 (R170.2 R205.1)
SW0: HV_DAC_8ch_FPGA (U1.K15), HV_DAC_8ch_FPGA_Config (R33.1)
SW1: HV_DAC_8ch_FPGA (U1.B8), HV_DAC_8ch_FPGA_Config (R35.1)

## Assembly variants
STD: not fitted C35_1 C35_2 C35_3 C35_4 C35_5 C35_6 C35_7 C35_8 C66_1 C66_2 C66_3 C66_4 C66_5 C66_6 C66_7 C66_8 C68_1 C68_2 C68_3 C68_4 C68_5 C68_6 C68_7 C68_8 C89_1 C89_2 C89_3 C89_4 C89_5 C89_6 C89_7 C89_8 C94 IC10 IC12 IC25 IC28 J8 J9 R3 R7 R233 RN1_1 RN1_2 RN1_3 RN1_4 RN1_5 RN1_6 RN1_7 RN1_8
DIOT_High_Precision: not fitted C35_1 C35_2 C35_3 C35_4 C35_5 C35_6 C35_7 C35_8 C66_1 C66_2 C66_3 C66_4 C66_5 C66_6 C66_7 C66_8 C68_1 C68_2 C68_3 C68_4 C68_5 C68_6 C68_7 C68_8 C89_1 C89_2 C89_3 C89_4 C89_5 C89_6 C89_7 C89_8 C94 IC10 IC12 R7 RN1_1 RN1_2 RN1_3 RN1_4 RN1_5 RN1_6 RN1_7 RN1_8; alternate parts RN5_1 -> RN_10K_10K_VISHAY_Y1747V0008QT9, RN5_2 -> RN_10K_10K_VISHAY_Y1747V0008QT9, RN5_8 -> RN_10K_10K_VISHAY_Y1747V0008QT9, RN5_7 -> RN_10K_10K_VISHAY_Y1747V0008QT9, RN5_6 -> RN_10K_10K_VISHAY_Y1747V0008QT9, RN5_5 -> RN_10K_10K_VISHAY_Y1747V0008QT9, RN5_4 -> RN_10K_10K_VISHAY_Y1747V0008QT9, RN5_3 -> RN_10K_10K_VISHAY_Y1747V0008QT9